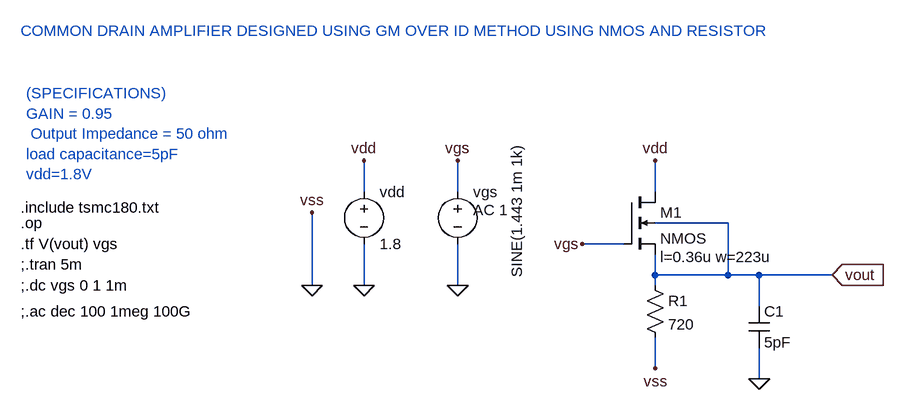
[diagram p0: schematic Assignment_CDAmp.asc]
Assignment_CDAmp.asc, the LTspice schematic file:
Version 4
SHEET 1 880 680
WIRE -128 128 -128 80
WIRE 16 128 16 80
WIRE 320 128 320 80
WIRE 432 176 320 176
WIRE 272 208 208 208
WIRE 320 256 320 224
WIRE 432 256 432 176
WIRE 432 256 320 256
WIRE 480 256 432 256
WIRE 592 256 480 256
WIRE -208 272 -208 160
WIRE -128 272 -128 208
WIRE 16 272 16 208
WIRE 320 272 320 256
WIRE 480 304 480 256
WIRE 320 400 320 352
WIRE 480 416 480 368
FLAG 16 272 0
FLAG -128 272 0
FLAG -208 272 0
FLAG -128 80 vdd
FLAG 16 80 vgs
FLAG 320 400 vss
FLAG 208 208 vgs
FLAG 320 80 vdd
FLAG 592 256 vout
IOPIN 592 256 In
FLAG 480 416 0
FLAG -208 160 vss
DATAFLAG 336 256 ""
DATAFLAG 256 208 ""
SYMBOL nmos4 272 128 R0
WINDOW 123 56 100 Left 2
SYMATTR Value2 l=0.36u w=223u
SYMATTR InstName M1
SYMBOL voltage -128 112 R0
WINDOW 123 0 0 Left 0
WINDOW 39 0 0 Left 0
SYMATTR InstName vdd
SYMATTR Value 1.8
SYMBOL voltage 16 112 R0
WINDOW 123 24 44 Left 2
WINDOW 39 0 0 Left 0
WINDOW 3 91 -58 VRight 2
SYMATTR Value2 AC 1
SYMATTR Value SINE(1.443 1m 1k)
SYMATTR InstName vgs
SYMBOL res 304 256 R0
SYMATTR InstName R1
SYMATTR Value 720
SYMBOL cap 464 304 R0
SYMATTR InstName C1
SYMATTR Value 5pF
TEXT -656 152 Left 2 !.include tsmc180.txt
TEXT -656 176 Left 2 !.op
TEXT -656 208 Left 2 !.tf V(vout) vgs
TEXT -656 240 Left 2 !;.tran 5m
TEXT -656 272 Left 2 !;.dc vgs 0 1 1m
TEXT -648 -24 Left 2 ;(SPECIFICATIONS)\nGAIN = 0.95\n Output Impedance = 50 ohm\nload capacitance=5pF\nvdd=1.8V
TEXT -656 -120 Left 2 ;COMMON DRAIN AMPLIFIER DESIGNED USING GM OVER ID METHOD USING NMOS AND RESISTOR
TEXT -656 312 Left 2 !;.ac dec 100 1meg 100G

The netlist it stands for:
* Assignment_CDAmp.asc
M1 vdd vgs vout vout NMOS l=0.36u w=223u
vdd vdd 0 1.8
vgs vgs 0 SINE(1.443 1m 1k) AC 1
R1 vout 0 720
C1 vout 0 5pF
.model NMOS NMOS
.model PMOS PMOS
.lib standard.mos
.include tsmc180.txt
.op
.tf V(vout) vgs
;.tran 5m
;.dc vgs 0 1 1m
* (SPECIFICATIONS)
* GAIN = 0.95
*  Output Impedance = 50 ohm
* load capacitance=5pF
* vdd=1.8V
* COMMON DRAIN AMPLIFIER DESIGNED USING GM OVER ID METHOD USING NMOS AND RESISTOR
;.ac dec 100 1meg 100G
.backanno
.end